# EasyEDA Pro project SMPS_V1.epro, schematic LVsense
Board Name: PCB41; Create Date: 2026-03-21; Page Name: P1; Project Name: TL494-PSU-V1; Schematic Name: LVsense; Update Date: 2026-03-21; Company: EasyEDA.com; Page Size: A4; Version: V1.0
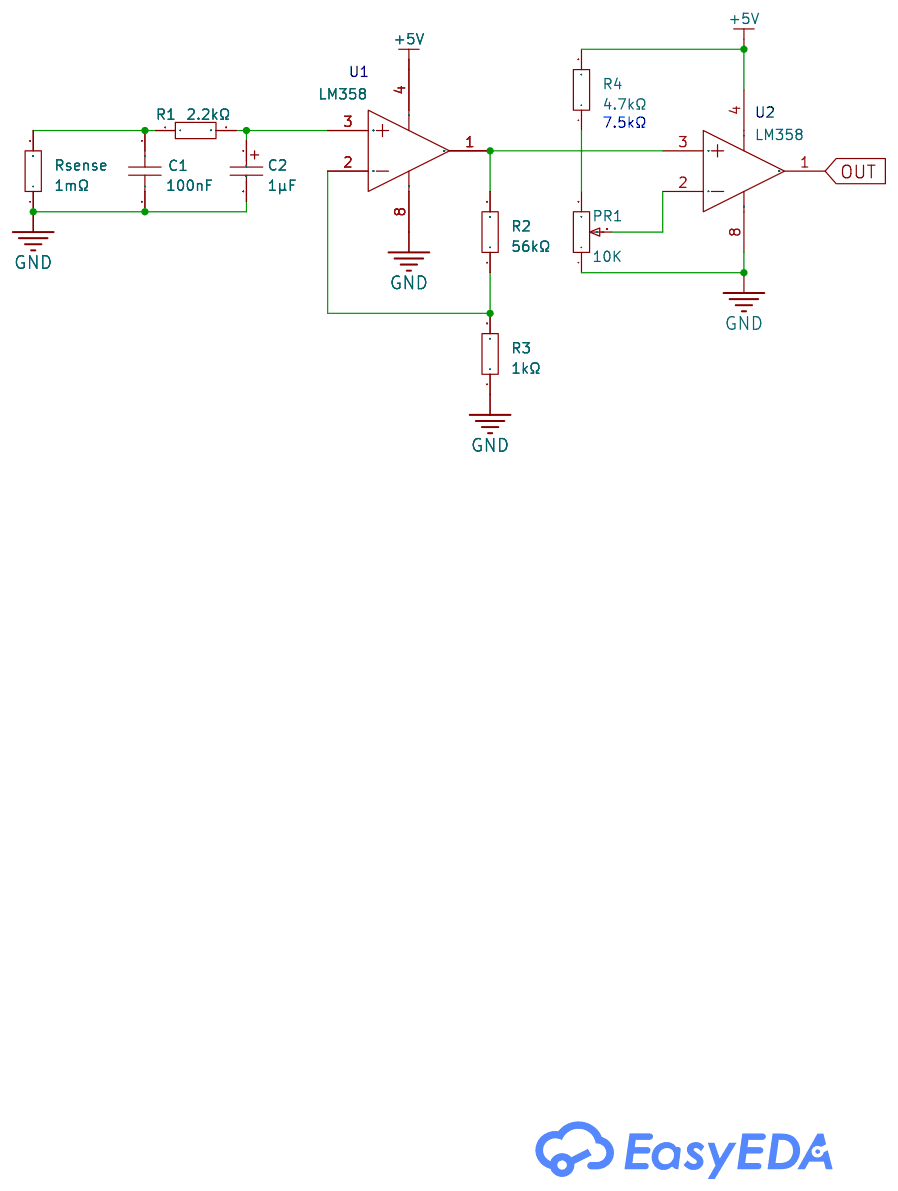
[diagram p0: schematic sheet]

## Parts
C1  100nF  [C0201]
C2  1µF  [CAP-SMD_BD3.0-L3.3-W3.3-RD]
PR1  10K  [RES-ADJ-TH_3P-L9.5-W9.5-P2.54-BR-BS]
R1  2.2kΩ  [R0603]
R2  56kΩ  [R0603]
R3  1kΩ  [R0603]
R4  4.7kΩ  [R0603]
Rsense  1mΩ  [R0603]
U1  LM358  [SOP-8_L4.9-W3.9-P1.27-LS6.0-BL]  (section 1)
U2  LM358  [SOP-8_L4.9-W3.9-P1.27-LS6.0-BL]  (section 1)

## Library data of the parts
C1 = CAP_0201: Supplier Footprint: 0201
C2 = C_Ele_SMD_3x5.4mm: Supplier Footprint: SMD,3x5.4mm
PR1 = R_3386P: Supplier Footprint: Through
R1-R4 Rsense = Res_0603: Supplier Footprint: 0603
U1 U2 = LM358_C5252902: Number of Channels:2 Maximum Power Supply Range (Vdd-Vss):40V Rail to Rail:- Gain Bandwidth Product:1.2MHz Vos - Input Offset Voltage:5mV Input Offset Voltage Drift(Vos TC):- Slew Rate:- Ib - Input Bias Current:250nA Input Offset Current(Ios):50nA Input V; LCSC Part Name: 增益带宽(GBP):1.2MHz VIO:5mV  LM358; Supplier Part: C5252902; Manufacturer: MSKSEMI(美森科); Supplier Footprint: SOP-8; JLCPCB Part Class: Extended Part; Datasheet: https://item.szlcsc.com/datasheet/LM358/5971203.html; Supplier: LCSC; Number of Channels: 2; Maximum Power Supply Range (Vdd-Vss): 40V; Gain Bandwidth Product: 1.2MHz; Vos - Input Offset Voltage: 5mV; Ib - Input Bias Current: 250nA; Input Offset Current(Ios): 50nA; Common Mode Rejection Ratio(CMRR): 80dB; Quiescent Current: 500uA; Output Current: 24mA; Operating Temperature: 0℃~+70℃; Single supply: 3V~36V; Dual Supply: -18V~18V

## Nets
+5V: R4.2 U1.4(VEE) U2.4(VEE)
GND: C1.2 C2.2 PR1.1 R3.1 Rsense.1 U1.8(VCC) U2.8(VCC)
OUT: U2.1(OUT1)
$1N157: C1.1 R1.1 Rsense.2
$1N285: C2.1 R1.2 U1.3(IN1+)
$1N629: R2.2 U1.1(OUT1) U2.3(IN1+)
$1N739: R2.1 R3.2 U1.2(IN1-)
$1N969: PR1.2 U2.2(IN1-)
$1N1176: PR1.3 R4.1

## Notes on the sheet
- U1
- 7.5kΩ
- U2
